# EAGLE board zx80_build034.routed (EAGLE 7.5.0), part 1 of 2
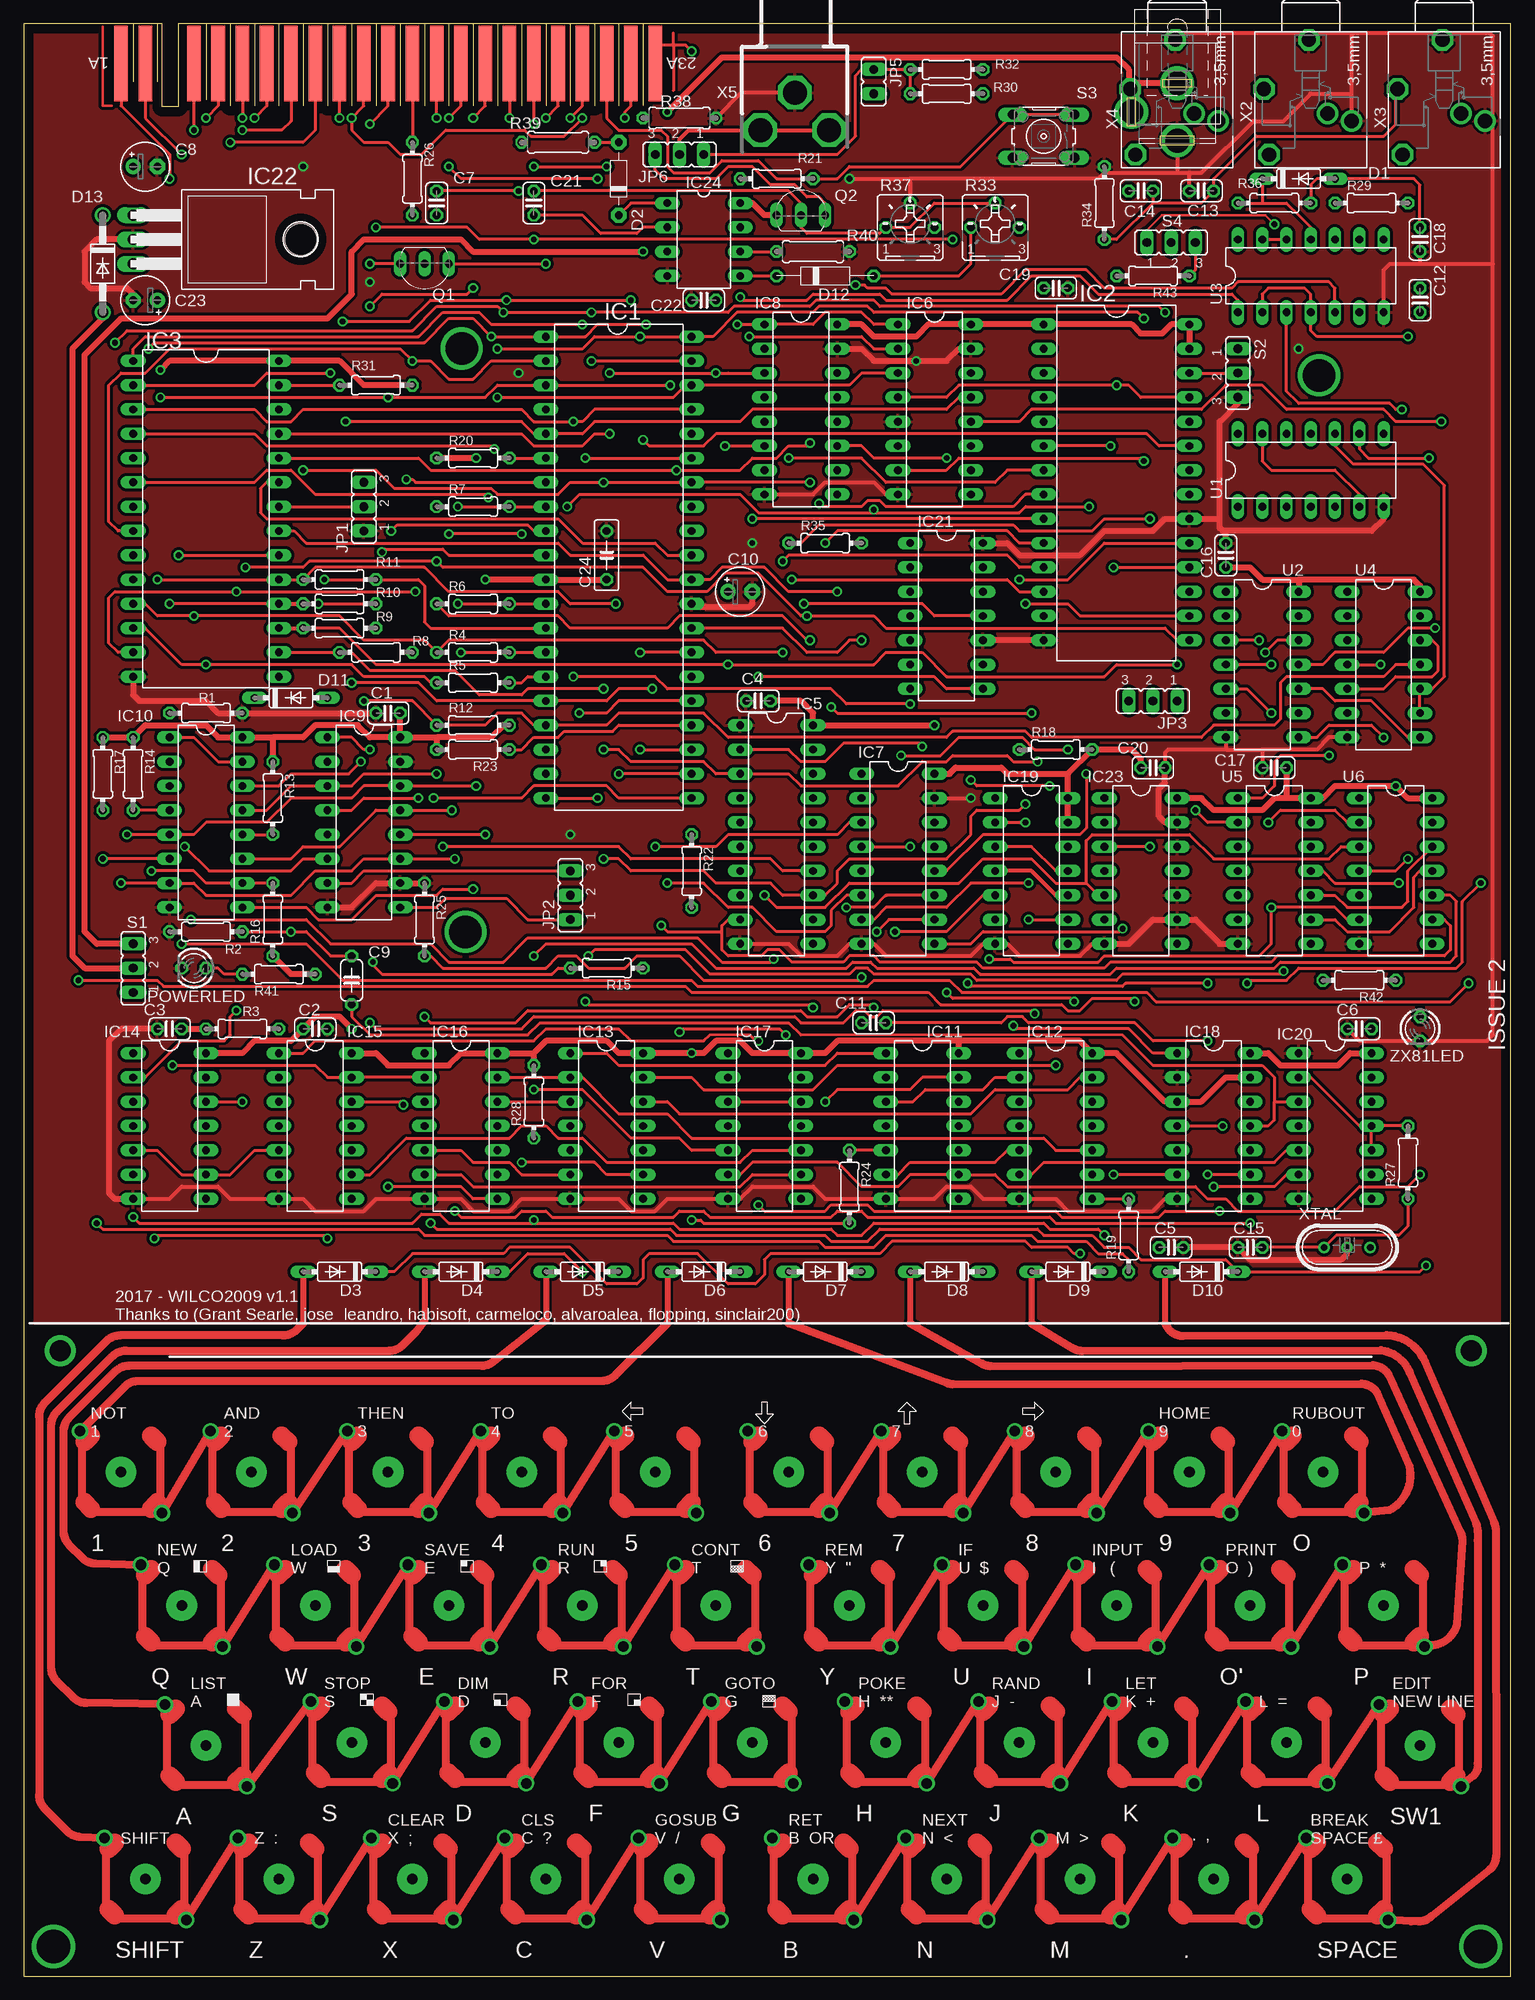
[diagram p4: board, top side]
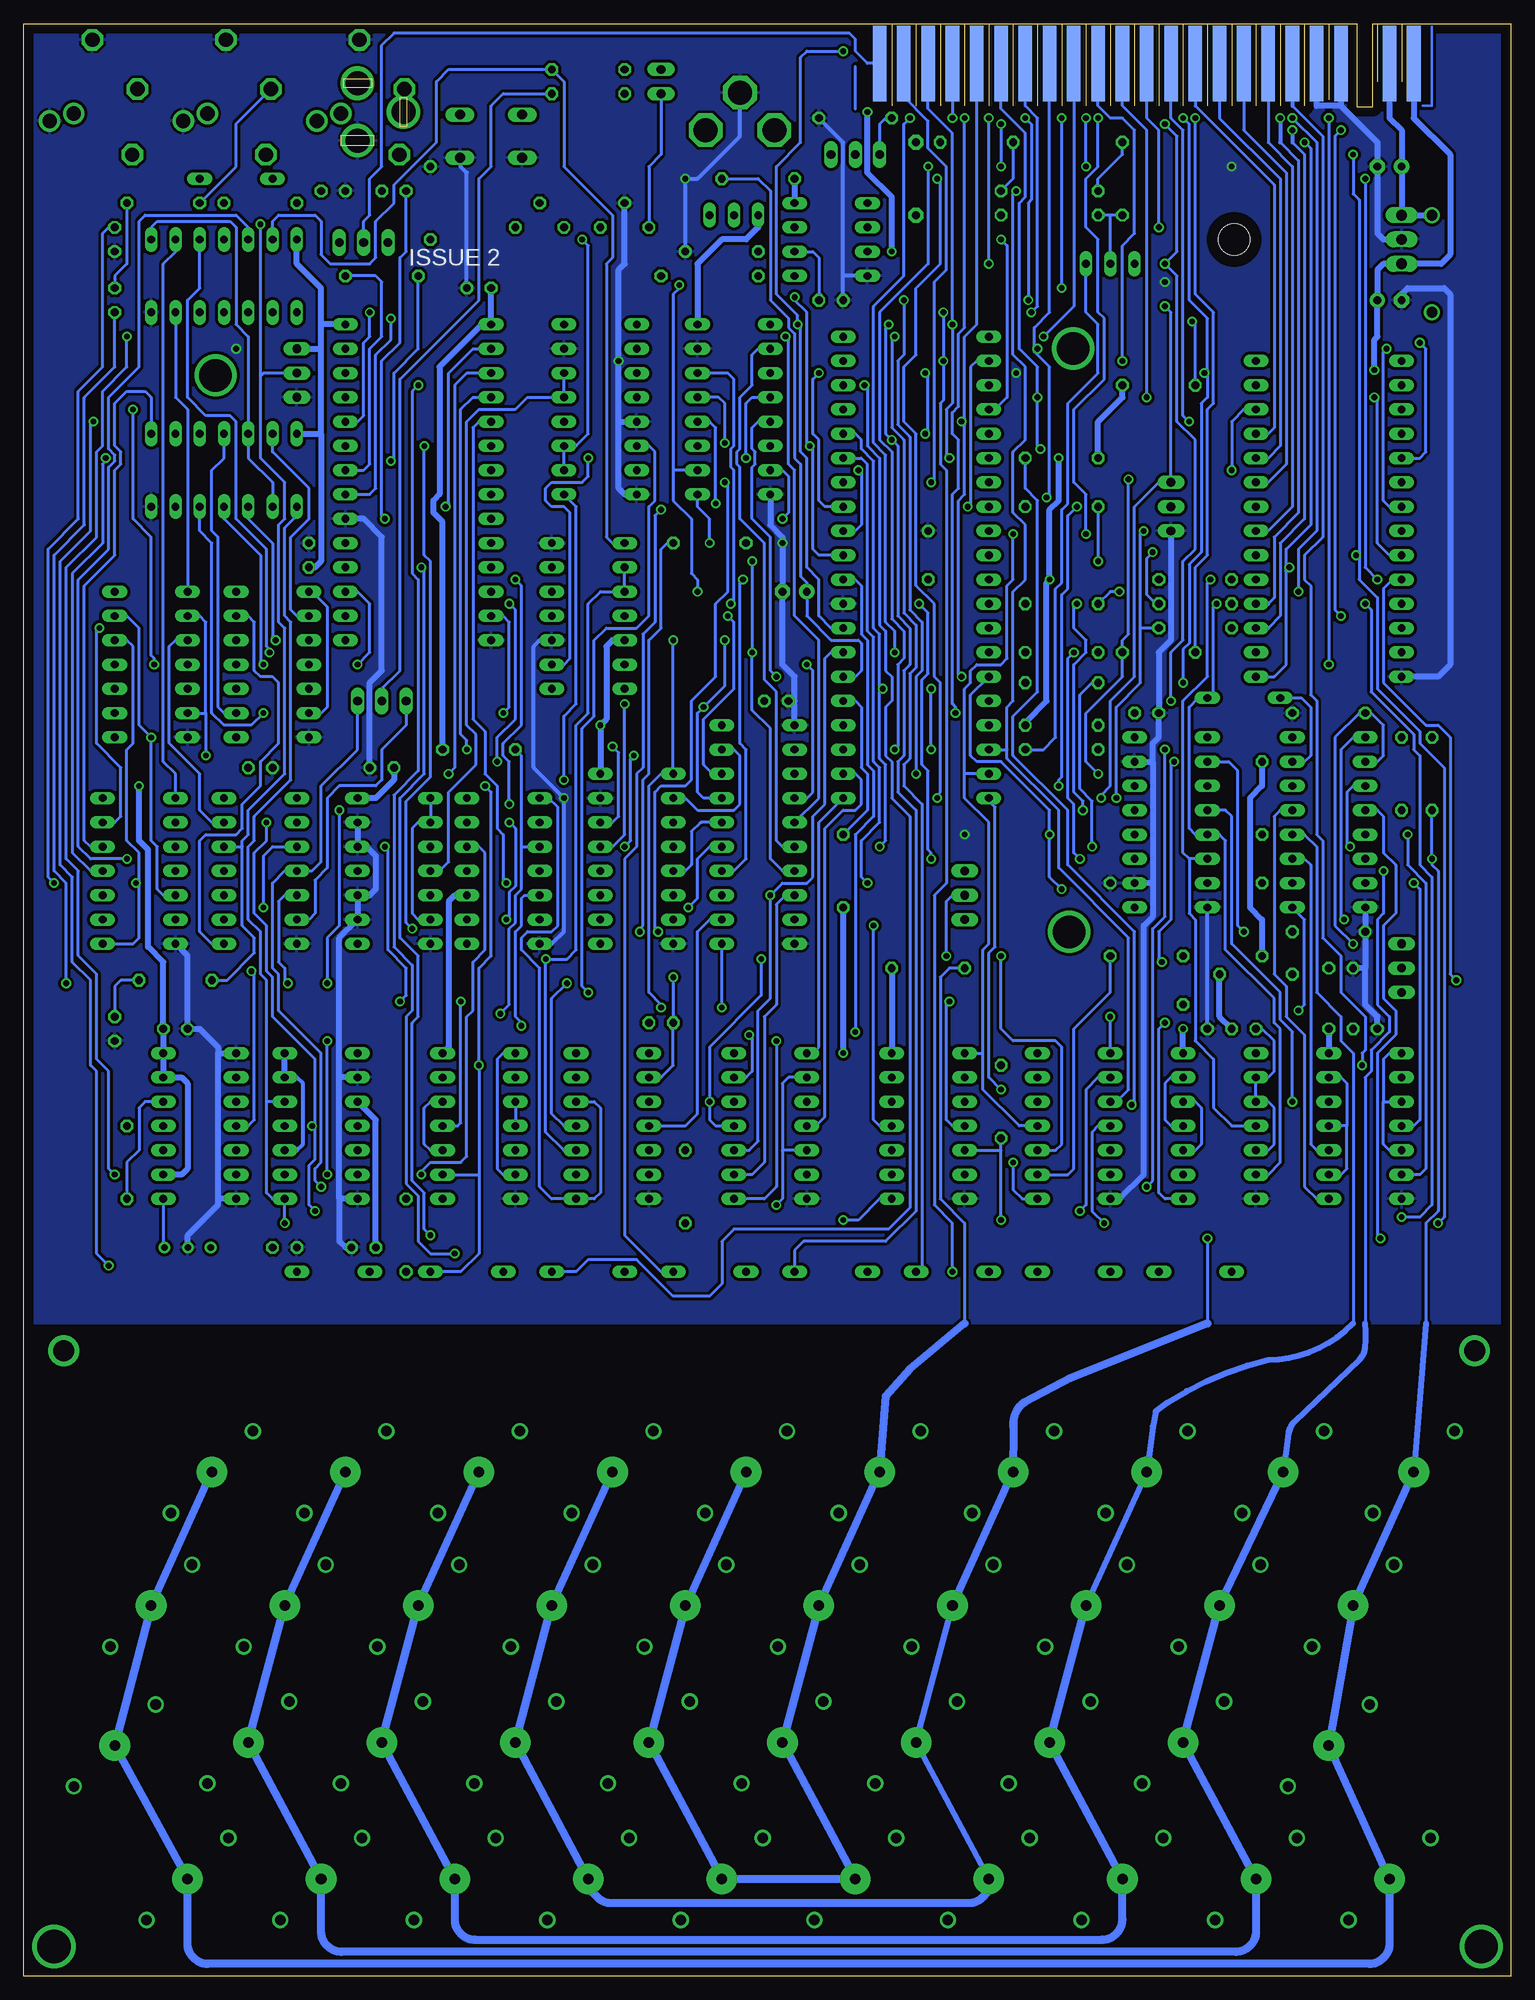
[diagram p5: board, bottom side, seen from below]

Size 155.56 x 204.15 mm. Coordinates in mm from the lower left corner, seen from the top.
Outline: 19.05,204.15 155.56,204.15 155.56,0 0,0 0,204.15 11.43,204.15
Outline: 19.05,204.15 16.14,204.15 16.14,195.47 14.46,195.47 14.46,204.15 13.97,204.15
Outline: 13.97,204.15 11.43,204.15
Outline: 19.05,204.15 19.05,196.22
Outline: 13.97,204.15 13.97,198.12
Outline: 11.43,204.15 11.43,198.12
Outline: 21.59,204.15 21.59,195.58
Outline: 26.67,204.15 26.67,195.58
Outline: 29.21,204.15 29.21,195.58
Outline: 34.29,204.15 34.29,195.58
Outline: 39.37,204.15 39.37,195.58
Outline: 41.91,204.15 41.91,195.58
Outline: 44.45,204.15 44.45,195.58
Outline: 46.99,204.15 46.99,195.58
Outline: 49.53,204.15 49.53,195.58
Outline: 24.13,204.15 24.13,195.58
Outline: 31.75,204.15 31.75,195.58
Outline: 36.83,204.15 36.83,195.58
Outline: 52.07,204.15 52.07,195.58
Outline: 54.61,204.15 54.61,195.58
Outline: 57.15,204.15 57.15,195.58
Outline: 59.69,204.15 59.69,195.58
Outline: 62.23,204.15 62.23,195.58
Outline: 64.77,204.15 64.77,195.58
Copper layers (1*16): Top 0.035mm / dielectric 1.5mm / Bottom 0.035mm
Design rules "default *": minimum track width 10mil, minimum drill 20mil, track to track 8mil, track to pad 8mil, pad to pad 8mil, via to via 8mil, smd to smd 8mil, copper to edge 40mil, drill to drill 8mil, minimum pad ring 10mil, minimum via ring 8mil, stop-mask expansion 4mil, vias tented up to drill 0mil, thermal gap 10mil
Net classes: 1 VCC: width 0.5 mm

## Footprints (pad centres in the part's own frame; a part is rotated, then mirrored left to right if it is on the bottom)
TA_DK = drill 1.1 pad 3.2: 1 0,0 | drill 1.1 pad 1.7: 2@1 4.282,-4.282; 2@8 -4.282,4.282
EDGEPIN = smd 1.422 x 7.874: 1 0,0
C025-024X044 = drill 0.813 octagon: 1 -1.27,0; 2 1.27,0
E2,5-5 = drill 0.813 pad 1.6: + -1.27,0 | drill 0.813 pad 1.6 octagon: - 1.27,0
C050-024X044 = drill 0.813 octagon: 1 -2.54,0; 2 2.54,0
C050-025X075 = drill 0.813 octagon: 1 -2.54,0; 2 2.54,0
DO35-7 = drill 0.813 long: A 3.81,0; C -3.81,0
D-7,5 = drill 0.813 pad 1.6 octagon: 1 -3.81,0; 2 3.81,0
D-10/2 = drill 0.813 octagon: P$3 -5.08,0; P$4 5.08,0
DO41-10 = drill 1.118: A 5.08,0; C -5.08,0
DIL40 = drill 0.813 long: 1 -24.13,-7.62; 2 -21.59,-7.62; 3 -19.05,-7.62; 4 -16.51,-7.62; 5 -13.97,-7.62; 6 -11.43,-7.62; 7 -8.89,-7.62; 8 -6.35,-7.62; 9 -3.81,-7.62; 10 -1.27,-7.62; 11 1.27,-7.62; 12 3.81,-7.62; 13 6.35,-7.62; 14 8.89,-7.62; 15 11.43,-7.62; 16 13.97,-7.62; 17 16.51,-7.62; 18 19.05,-7.62; 19 21.59,-7.62; 20 24.13,-7.62; 21 24.13,7.62; 22 21.59,7.62; 23 19.05,7.62; 24 16.51,7.62; 25 13.97,7.62; 26 11.43,7.62; 27 8.89,7.62; 28 6.35,7.62; 29 3.81,7.62; 30 1.27,7.62; 31 -1.27,7.62; 32 -3.81,7.62; 33 -6.35,7.62; 34 -8.89,7.62; 35 -11.43,7.62; 36 -13.97,7.62; 37 -16.51,7.62; 38 -19.05,7.62; 39 -21.59,7.62; 40 -24.13,7.62
DIL28-6 = drill 0.813 long: 1 -16.51,-7.62; 2 -13.97,-7.62; 3 -11.43,-7.62; 4 -8.89,-7.62; 5 -6.35,-7.62; 6 -3.81,-7.62; 7 -1.27,-7.62; 8 1.27,-7.62; 9 3.81,-7.62; 10 6.35,-7.62; 11 8.89,-7.62; 12 11.43,-7.62; 13 13.97,-7.62; 14 16.51,-7.62; 15 16.51,7.62; 16 13.97,7.62; 17 11.43,7.62; 18 8.89,7.62; 19 6.35,7.62; 20 3.81,7.62; 21 1.27,7.62; 22 -1.27,7.62; 23 -3.81,7.62; 24 -6.35,7.62; 25 -8.89,7.62; 26 -11.43,7.62; 27 -13.97,7.62; 28 -16.51,7.62
DIL20 = drill 0.813 long: 1 -11.43,-3.81; 2 -8.89,-3.81; 3 -6.35,-3.81; 4 -3.81,-3.81; 5 -1.27,-3.81; 6 1.27,-3.81; 7 3.81,-3.81; 8 6.35,-3.81; 9 8.89,-3.81; 10 11.43,-3.81; 11 11.43,3.81; 12 8.89,3.81; 13 6.35,3.81; 14 3.81,3.81; 15 1.27,3.81; 16 -1.27,3.81; 17 -3.81,3.81; 18 -6.35,3.81; 19 -8.89,3.81; 20 -11.43,3.81
DIL16 = drill 0.813 long: 1 -8.89,-3.81; 2 -6.35,-3.81; 3 -3.81,-3.81; 4 -1.27,-3.81; 5 1.27,-3.81; 6 3.81,-3.81; 7 6.35,-3.81; 8 8.89,-3.81; 9 8.89,3.81; 10 6.35,3.81; 11 3.81,3.81; 12 1.27,3.81; 13 -1.27,3.81; 14 -3.81,3.81; 15 -6.35,3.81; 16 -8.89,3.81
DIL14 = drill 0.813 long: 1 -7.62,-3.81; 2 -5.08,-3.81; 3 -2.54,-3.81; 4 0,-3.81; 5 2.54,-3.81; 6 5.08,-3.81; 7 7.62,-3.81; 8 7.62,3.81; 9 5.08,3.81; 10 2.54,3.81; 11 0,3.81; 12 -2.54,3.81; 13 -5.08,3.81; 14 -7.62,3.81
TO220H = drill 1.118 long: 1 -2.54,-12.7; 2 0,-12.7; 3 2.54,-12.7 | hole 3.302: 0,4.826
DIL08 = drill 0.813 long: 1 -3.81,-3.81; 2 -1.27,-3.81; 3 1.27,-3.81; 4 3.81,-3.81; 5 3.81,3.81; 6 1.27,3.81; 7 -1.27,3.81; 8 -3.81,3.81
SPC4077 = drill 2.5 pad 3.5: 1 -3,0; 2 0,-4.8; 3 3,0
JP2 = drill 0.914 long: 1 -2.54,0; 2 0,0; 3 2.54,0
JP1 = drill 0.914 long: 1 0,-1.27; 2 0,1.27
LED3MM = drill 0.813 octagon: A -1.27,0; K 1.27,0
TO92-EBC = drill 0.813 long: B 0,-1.27; C -2.54,-1.27; E 2.54,-1.27
0204/7 = drill 0.813 octagon: 1 -3.81,0; 2 3.81,0
B25P = drill 0.813 octagon: A -2.54,0; E 2.54,0; S 0,2.54
0207/7 = drill 0.813 octagon: 1 -3.81,0; 2 3.81,0
B3F-10XX = drill 1.016 long: 1 -3.251,2.261; 2 3.251,2.261; 3 -3.251,-2.261; 4 3.251,-2.261
PG203J = drill 1.499 octagon: 1 -6.274,-0.203; 4 5.74,-4.369; 5 -1.118,-4.902 | drill 1.499: 2 2.21,4.267; 3 1.448,1.753
736880-49 = drill 2.5 pad 3.302 octagon: 1 -0.11,0; 2 3.81,3.595; 2@2 3.81,-3.595
HC49U = drill 0.7 pad 1.2: 1 -2.413,0; 2 -0.027,0; 3 2.413,0

## Placement (x,y rotation side)
1  TA_DK  [TA_DK]  10.16,52.7 0 top
1A  [EDGEPIN]  10.16,200.03 0 top
1B  [EDGEPIN]  10.16,200.03 0 bottom
2  TA_DK  [TA_DK]  23.81,52.7 0 top
2A  [EDGEPIN]  12.7,200.03 0 top
2B  [EDGEPIN]  12.7,200.03 0 bottom
3  TA_DK  [TA_DK]  38.1,52.7 0 top
4  TA_DK  [TA_DK]  52.07,52.7 0 top
4A  [EDGEPIN]  17.78,200.03 0 top
4B  [EDGEPIN]  17.78,200.03 0 bottom
5  TA_DK  [TA_DK]  66.04,52.7 0 top
5A  [EDGEPIN]  20.32,200.03 0 top
5B  [EDGEPIN]  20.32,200.03 0 bottom
6  TA_DK  [TA_DK]  80.01,52.7 0 top
6A  [EDGEPIN]  22.86,200.03 0 top
6B  [EDGEPIN]  22.86,200.03 0 bottom
7  TA_DK  [TA_DK]  93.98,52.7 0 top
7A  [EDGEPIN]  25.4,200.03 0 top
7B  [EDGEPIN]  25.4,200.03 0 bottom
8  TA_DK  [TA_DK]  107.95,52.7 0 top
8A  [EDGEPIN]  27.94,200.03 0 top
8B  [EDGEPIN]  27.94,200.03 0 bottom
9  TA_DK  [TA_DK]  121.92,52.7 0 top
9A  [EDGEPIN]  30.48,200.03 0 top
9B  [EDGEPIN]  30.48,200.03 0 bottom
10A  [EDGEPIN]  33.02,200.03 0 top
10B  [EDGEPIN]  33.02,200.03 0 bottom
11A  [EDGEPIN]  35.56,200.03 0 top
11B  [EDGEPIN]  35.56,200.03 0 bottom
12A  [EDGEPIN]  38.1,200.03 0 top
12B  [EDGEPIN]  38.1,200.03 0 bottom
13A  [EDGEPIN]  40.64,200.03 0 top
13B  [EDGEPIN]  40.64,200.03 0 bottom
14A  [EDGEPIN]  43.18,200.03 0 top
14B  [EDGEPIN]  43.18,200.03 0 bottom
15A  [EDGEPIN]  45.72,200.03 0 top
15B  [EDGEPIN]  45.72,200.03 0 bottom
16A  [EDGEPIN]  48.26,200.03 0 top
16B  [EDGEPIN]  48.26,200.03 0 bottom
17A  [EDGEPIN]  50.8,200.03 0 top
17B  [EDGEPIN]  50.8,200.03 0 bottom
18A  [EDGEPIN]  53.34,200.03 0 top
18B  [EDGEPIN]  53.34,200.03 0 bottom
19A  [EDGEPIN]  55.88,200.03 0 top
19B  [EDGEPIN]  55.88,200.03 0 bottom
20A  [EDGEPIN]  58.42,200.03 0 top
20B  [EDGEPIN]  58.42,200.03 0 bottom
21A  [EDGEPIN]  60.96,200.03 0 top
21B  [EDGEPIN]  60.96,200.03 0 bottom
22A  [EDGEPIN]  63.5,200.03 0 top
22B  [EDGEPIN]  63.5,200.03 0 bottom
23A  [EDGEPIN]  66.04,200.03 0 top
23B  [EDGEPIN]  66.04,200.03 0 bottom
.  TA_DK  [TA_DK]  124.46,10.16 0 top
A  TA_DK  [TA_DK]  19.05,24.13 0 top
B  TA_DK  [TA_DK]  82.55,10.16 0 top
C  TA_DK  [TA_DK]  54.61,10.16 0 top
C1  47nF  [C025-024X044]  38.1,132.08 180 top
C2  47nF  [C025-024X044]  30.48,99.06 0 top
C3  47nF  [C025-024X044]  15.24,99.06 180 top
C4  47nF  [C025-024X044]  76.83,133.35 180 top
C5  47nF  [C025-024X044]  120.02,76.2 0 top
C6  100nF  [C025-024X044]  139.7,99.06 180 top
C7  100pF  [C025-024X044]  43.18,185.42 90 top
C8  22uF  [E2,5-5]  12.7,189.23 0 top
C9  47pF  [C050-024X044]  34.29,104.14 270 top
C10  1uF  [E2,5-5]  74.93,144.78 0 top
C11  47pF  [C025-024X044]  88.9,99.69 180 top
C12  47nF  [C025-024X044]  146.05,175.26 270 top
C13  47nF  [C025-024X044]  123.19,186.69 180 top
C14  47pF  [C025-024X044]  116.84,186.69 0 top
C15  220pF  [C025-024X044]  128.27,76.2 0 top
C16  47nF  [C025-024X044]  125.73,148.59 90 top
C17  47nF  [C025-024X044]  130.81,126.36 180 top
C18  10nF  [C025-024X044]  146.05,181.61 270 top
C19  47nF  [C025-024X044]  107.95,176.53 0 top
C20  47nF  [C025-024X044]  118.11,126.36 0 top
C21  100nF  [C025-024X044]  53.34,185.42 270 top
C22  100n  [C025-024X044]  71.12,175.26 0 top
C23  100uF  [E2,5-5]  12.7,175.26 180 top
C24  100nF  [C050-025X075]  60.96,148.59 90 top
D  TA_DK  [TA_DK]  48.26,24.45 0 top
D1  1N4148DO35-7  [DO35-7]  133.35,187.96 0 top
D2  [D-7,5]  62.23,187.96 270 top
D3  1N4148DO35-7  [DO35-7]  33.02,73.66 180 top
D4  1N4148DO35-7  [DO35-7]  45.72,73.66 180 top
D5  1N4148DO35-7  [DO35-7]  58.42,73.66 180 top
D6  1N4148DO35-7  [DO35-7]  71.12,73.66 180 top
D7  1N4148DO35-7  [DO35-7]  83.82,73.66 180 top
D8  1N4148DO35-7  [DO35-7]  96.52,73.66 180 top
D9  1N4148DO35-7  [DO35-7]  109.22,73.66 180 top
D10  1N4148DO35-7  [DO35-7]  123.19,73.66 180 top
D11  NTSC ONLY  [DO35-7]  27.94,133.67 0 top
D12  [D-10/2]  83.82,177.8 180 top
D13  1N4007  [DO41-10]  8.26,179.07 270 top
E  TA_DK  [TA_DK]  44.45,38.73 0 top
F  TA_DK  [TA_DK]  62.23,24.45 0 top
G  TA_DK  [TA_DK]  76.2,24.45 0 top
H  TA_DK  [TA_DK]  90.17,24.45 0 top
I  TA_DK  [TA_DK]  114.3,38.73 0 top
IC1  Z80A  [DIL40]  62.23,147.32 270 top
IC2  27C128P  [DIL28-6]  114.3,156.21 270 top
IC3  CY62256LL-PC  [DIL28-6]  19.05,152.4 270 top
IC5  74S373N  [DIL20]  78.74,119.38 270 top
IC6  74157N  [DIL16]  95.25,163.83 270 top
IC7  74157N  [DIL16]  91.44,116.84 270 top
IC8  74157N  [DIL16]  81.28,163.83 270 top
IC9  74165N  [DIL16]  35.56,120.65 270 top
IC10  74LS365N  [DIL16]  19.05,120.65 270 top
IC11  74LS00N  [DIL14]  93.98,88.9 270 top
IC12  74LS00N  [DIL14]  107.95,88.9 270 top
IC13  74LS04N  [DIL14]  60.96,88.9 270 top
IC14  74LS05N  [DIL14]  15.24,88.9 270 top
IC15  74LS05N  [DIL14]  30.48,88.9 270 top
IC16  74LS10N  [DIL14]  45.72,88.9 270 top
IC17  74LS32N  [DIL14]  77.47,88.9 270 top
IC18  74LS74N  [DIL14]  124.46,88.9 270 top
IC19  74LS74N  [DIL14]  105.41,115.57 270 top
IC20  74LS86N  [DIL14]  137.16,88.9 270 top
IC21  74LS93N  [DIL14]  96.52,142.24 270 top
IC22  7805T  [TO220H]  24.13,181.61 270 top
IC23  74LS00N  [DIL14]  116.84,115.57 270 top
IC24  LM1881  [DIL08]  71.12,181.61 270 top
J  TA_DK  [TA_DK]  104.14,24.45 0 top
J1  [SPC4077]  120.65,194.94 270 top
JP1  [JP2]  35.56,153.67 90 top
JP2  VIDEO_MODE  [JP2]  57.15,113.03 90 top
JP3  [JP2]  118.11,133.35 180 top
JP5  [JP1]  88.9,198.12 180 top
JP6  [JP2]  68.58,190.5 180 top
K  TA_DK  [TA_DK]  118.11,24.45 0 top
L  TA_DK  [TA_DK]  132.08,24.45 0 top
M  TA_DK  [TA_DK]  110.49,10.16 0 top
N  TA_DK  [TA_DK]  96.52,10.16 0 top
O  TA_DK  [TA_DK]  135.89,52.7 0 top
O'  TA_DK  [TA_DK]  128.27,38.73 0 top
P  TA_DK  [TA_DK]  142.24,38.73 0 top
POWERLED  RED  [LED3MM]  17.78,105.41 180 top
Q  TA_DK  [TA_DK]  16.51,38.73 0 top
Q1  BC548  [TO92-EBC]  41.91,177.8 180 top
Q2  BC548  [TO92-EBC]  81.28,185.42 0 top
R  TA_DK  [TA_DK]  58.42,38.73 0 top
R1  1K  [0204/7]  19.05,132.08 180 top
R2  470  [0204/7]  19.05,109.22 0 top
R3  1K  [0204/7]  22.86,99.06 0 top
R4  1K  [0204/7]  46.99,138.43 0 top
R5  1K  [0204/7]  46.99,135.25 0 top
R6  1K  [0204/7]  46.99,143.51 0 top
R7  1K  [0204/7]  46.99,153.67 0 top
R8  1K  [0204/7]  36.83,138.43 0 top
R9  1K  [0204/7]  33.02,140.97 0 top
R10  1K  [0204/7]  33.02,143.51 0 top
R11  1K  [0204/7]  33.02,146.05 0 top
R12  1K  [0204/7]  46.99,130.81 0 top
R13  47K  [0204/7]  26.04,123.19 270 top
R14  47K  [0204/7]  11.43,125.73 270 top
R15  47K  [0204/7]  60.96,105.41 180 top
R16  47K  [0204/7]  26.04,110.49 90 top
R17  47K  [0204/7]  8.26,125.73 270 top
R18  1K  [0204/7]  107.95,128.27 180 top
R19  2K2  [0204/7]  115.57,77.47 90 top
R20  330  [0204/7]  46.99,158.75 180 top
R21  220K  [0204/7]  78.74,187.96 180 top
R22  1K  [0204/7]  69.85,115.57 270 top
R23  1K  [0204/7]  46.99,128.27 180 top
R24  1K  [0204/7]  86.36,82.55 270 top
R25  470  [0204/7]  41.91,110.49 270 top
R26  10K  [0204/7]  40.64,187.96 270 top
R27  1K  [0204/7]  144.78,85.09 90 top
R28  47K  [0204/7]  53.34,91.44 90 top
R29  180  [0204/7]  140.97,185.42 0 top
R30  1K  [0204/7]  96.52,196.85 180 top
R31  10K  [0204/7]  36.83,166.37 180 top
R32  330  [0204/7]  96.52,199.39 180 top
R33  1K  [B25P]  101.6,182.88 0 top
R34  1K  [0204/7]  113.03,185.42 90 top
R35  1M  [0204/7]  83.82,149.86 0 top
R36  2K7  [0204/7]  130.81,185.42 180 top
R37  4K7  [B25P]  92.71,182.88 0 top
R38  100  [0207/7]  68.58,194.31 180 top
R39  10k  [0207/7]  55.88,191.77 0 top
R40  820k  [0207/7]  82.55,180.34 180 top
R41  680  [0204/7]  26.67,104.78 180 top
R42  680  [0204/7]  139.7,104.14 180 top
R43  680  [0204/7]  118.11,177.8 180 top
S  TA_DK  [TA_DK]  34.29,24.45 0 top
S1  [JP2]  11.43,105.41 90 top
S2  [JP2]  127,167.64 270 top
S3  RESET  [B3F-10XX]  106.68,192.41 180 top
S4  [JP2]  120.02,181.29 0 top
SHIFT  TA_DK  [TA_DK]  12.7,10.16 0 top
SPACE  TA_DK  [TA_DK]  138.43,10.16 0 top
SW1  TA_DK  [TA_DK]  146.05,24.13 0 top
T  TA_DK  [TA_DK]  72.39,38.73 0 top
U  TA_DK  [TA_DK]  100.33,38.73 0 top
U1  74HC393N  [DIL14]  134.62,157.48 0 top
U2  74AC11N  [DIL14]  129.54,137.16 270 top
U3  74LS32N  [DIL14]  134.62,177.8 0 top
U4  74LS00N  [DIL14]  142.24,137.16 270 top
U5  74LS08N  [DIL14]  130.81,115.57 270 top
U6  74LS02N  [DIL14]  143.51,115.57 270 top
V  TA_DK  [TA_DK]  68.58,10.16 0 top
W  TA_DK  [TA_DK]  30.48,38.73 0 top
X  TA_DK  [TA_DK]  40.64,10.16 0 top
X2  EAR  [PG203J]  134.62,196.22 270 top
X3  MIC  [PG203J]  148.59,196.22 270 top
X4  POWER  [PG203J]  120.65,196.22 270 top
X5  736880-49  [736880-49]  80.64,196.85 270 top
XTAL  6.5MHz  [HC49U]  138.43,76.2 0 top
Y  TA_DK  [TA_DK]  86.36,38.73 0 top
Z  TA_DK  [TA_DK]  26.67,10.16 0 top
ZX81LED  YELLOW  [LED3MM]  146.05,99.06 270 top

## Tracks (layer width: path | path; a pad name or v marks a point on that pad's centre or on a via)
2CLK
  Top 0.254: 81.28,98.42 114.94,98.42
  Top 0.305: C9.2 34.29,100.33 36.2,98.42 52.7,98.42 53.98,99.69 80.01,99.69 81.28,98.42 | 114.94,98.42 118.11,95.25 129.54,95.25 130.81,93.98 130.81,91.44 | 130.81,91.44 IC20.3 | IC18.11 130.18,88.9 130.81,89.53 130.81,91.44
9V
  Bottom 0.61: 2B.1 12.7,194.31 11.43,193.04 C8.+ IC22.1 D13.C
/BUSAK  (via drill 0.6)
  Top 0.305: 18A.1 v53.34,193.68 | v53.34,189.23 v60.96,189.23 | v64.45,128.27 IC1.23
  Bottom 0.305: v53.34,193.68 v53.34,189.23 | v60.96,189.23 60.96,179.07 66.04,173.99 66.04,160.66 64.77,159.38 64.77,141.92 63.5,140.65 63.5,137.79 64.14,137.16 64.14,128.59 v64.45,128.27
/BUSRQ  (via drill 0.6)
  Top 0.305: IC1.25 62.23,133.35 60.96,132.08 v58.1,132.08 | v57.15,194.31 58.42,195.58 20A.1
  Bottom 0.305: IC1.25 68.58,133.35 67.94,132.72 67.94,126.36 67.31,125.73 67.31,121.92 R22.1 | v58.1,132.08 58.1,132.72 58.42,133.03 58.42,154.94 57.78,155.57 57.78,160.66 58.42,161.29 58.42,163.51 57.78,164.15 57.78,171.77 57.15,172.4 v57.15,194.31
/CLOCK  (via drill 0.6)
  Top 0.305: v15.56,95.25 30.48,95.25 31.75,93.98 IC15.13 IC16.2 | v45.09,80.01 45.72,79.38 51.44,79.38 52.07,80.01 54.61,80.01 55.24,79.38 67.94,79.38 68.58,80.01 71.12,80.01 71.75,79.38 84.45,79.38 85.09,80.01 87.63,80.01 88.27,79.38 107.31,79.38 107.95,78.74 v128.27,78.74
  Bottom 0.305: 22.86,195.58 19.68,192.41 19.68,150.5 21.59,148.59 21.59,146.05 20.95,145.41 20.95,133.99 20.32,133.35 20.32,119.38 19.68,118.75 19.68,108.58 17.78,106.68 17.78,102.87 15.24,100.33 15.24,96.84 15.56,96.52 v15.56,95.25 | IC15.13 35.56,93.98 36.2,93.34 36.2,89.53 35.56,88.9 IC15.11 | IC16.2 43.18,93.98 44.45,92.71 44.45,80.64 v45.09,80.01 | v128.27,78.74 IC18.8 129.54,81.28 130.18,81.92 130.18,91.44 | IC18.12 130.18,91.44 | 130.18,91.44 130.18,104.14 130.81,104.78 130.81,109.22 132.08,110.49 132.08,118.11 131.44,118.75 131.44,121.28 127.64,125.09 127.64,141.6 128.27,142.24 128.27,151.45 127,152.72 U1.1
  Bottom 0.406: 6B.1 22.86,195.58
/HALT  (via drill 0.6)
  Top 0.305: v51.75,186.69 C7.2 | 13A.1 R26.1
  Bottom 0.305: IC16.3 41.27,91.44 40.01,92.71 40.01,108.58 47.31,115.89 47.31,121.92 52.7,127.32 52.7,128.27 | IC1.18 52.7,128.27 | 52.7,128.27 52.7,132.72 52.07,133.35 52.07,144.78 50.8,146.05 50.8,151.76 52.07,153.03 52.07,159.38 50.8,160.66 50.8,168.28 52.07,169.54 52.07,186.37 v51.75,186.69 | C7.2 43.18,187.96 40.64,190.5 R26.1
/IORQ  (via drill 0.6)
  Top 0.305: v76.83,80.64 77.47,80.01 83.82,80.01 84.45,80.64 88.27,80.64 88.9,80.01 107.95,80.01 108.58,79.38 118.75,79.38 119.38,80.01 v125.09,80.01 | IC18.4 v125.41,88.9 | v130.18,120.65 131.44,121.92 137.16,121.92 138.43,120.65 U6.2 | IC17.5 69.85,86.36 68.58,87.63 63.5,87.63 58.42,92.71 v53.34,92.71 | IC1.20 v60.01,123.19 | v60.01,187.96 45.72,187.96 v44.45,189.23 | v44.45,194.31 45.72,195.58 15A.1
  Bottom 0.305: IC17.2 75.56,93.98 76.2,93.34 76.2,86.36 | 76.2,86.36 76.2,81.28 v76.83,80.64 | IC17.5 76.2,86.36 | v125.09,80.01 125.73,80.64 125.73,84.77 125.09,85.41 125.09,88.58 v125.41,88.9 125.09,89.22 125.09,95.89 129.54,100.33 129.54,104.46 130.18,105.09 130.18,109.86 131.44,111.12 131.44,117.47 130.18,118.75 v130.18,120.65 | v53.34,92.71 54.61,93.98 54.61,107 53.98,107.63 53.98,122.24 54.61,122.87 IC1.20 | v60.01,123.19 60.01,123.51 59.69,123.83 59.69,135.25 60.33,135.89 60.33,143.51 62.23,145.41 62.23,161.29 63.5,162.56 63.5,168.28 62.23,169.54 62.23,176.53 59.69,179.07 59.69,187.64 v60.01,187.96 | v44.45,189.23 v44.45,194.31
/IORQ+/WR  (via drill 0.6)
  Top 0.305: IC17.6 74.93,83.82 76.2,85.09 85.09,85.09 87.63,82.55 91.44,82.55 92.71,83.82 IC11.9 101.6,83.82 102.87,82.55 122.56,82.55 123.83,81.28 125.73,81.28 127,80.01 137.16,80.01 139.7,82.55 144.78,82.55 v146.05,83.82 | v144.78,171.45 135.25,171.45 134.62,172.09 U3.4 134.62,175.9 133.99,176.53 130.18,176.53 129.54,175.9 U3.2
  Bottom 0.305: v146.05,83.82 146.69,84.45 146.69,94.61 147.96,95.89 147.96,104.78 149.86,106.68 149.86,115.57 151.13,116.84 151.13,147.32 147.96,150.5 147.96,159.38 147.32,160.02 147.32,165.74 144.78,168.28 v144.78,171.45
/KBD  (via drill 0.6)
  Top 0.305: IC10.1 17.78,129.54 20.32,127 IC10.15 | v17.46,110.49 29.53,110.49 32.07,107.95 42.55,107.95 44.45,106.05 50.16,106.05 52.7,108.58 70.48,108.58 73.03,106.05 78.11,106.05 v78.42,106.36 | IC11.13 93.98,93.98 92.71,92.71 85.09,92.71 v83.82,91.44
  Bottom 0.305: IC10.1 16.51,129.54 17.78,128.27 17.78,110.81 v17.46,110.49 | v78.42,106.36 78.42,102.55 83.82,97.16 v83.82,91.44 83.82,89.53 83.19,88.9 IC17.11 | D11.C 21.91,133.67 20.95,132.72 20.95,127.64 21.59,127 IC10.15
/M1  (via drill 0.6)
  Top 0.305: IC15.9 36.2,83.82 40.01,87.63 50.8,87.63 52.07,88.9 54.61,88.9 55.88,87.63 58.42,87.63 60.96,85.09 74.93,85.09 76.2,86.36 IC17.10 | v77.47,113.03 78.74,111.76 83.82,111.76 86.36,114.3 97.79,114.3 100.33,116.84 105.41,116.84 107.95,114.3 111.12,114.3 | 111.12,114.3 112.39,113.03 IC23.5 | 111.12,114.3 111.12,118.75 111.76,119.38 121.92,119.38 124.46,116.84 136.53,116.84 137.79,118.11 U6.3 | IC1.27 v64.45,138.43 | v62.87,194.31 62.87,194.94 63.5,195.58 22A.1
  Bottom 0.305: IC17.10 79.69,86.36 78.74,87.31 78.74,100.97 77.47,102.23 v77.47,113.03 76.2,114.3 73.66,114.3 73.03,114.94 73.03,121.28 71.75,122.56 71.75,137.79 71.12,138.43 IC1.27 | v64.45,138.43 64.45,140.65 65.41,141.6 65.41,159.07 66.67,160.34 66.67,174.62 63.5,177.8 63.5,193.68 v62.87,194.31
/MREQ  (via drill 0.6)
  Top 0.305: v52.07,150.81 v44.45,150.81 | v43.18,194.31 14A.1 | IC13.1 60.96,96.52 62.23,95.25 83.82,95.25 85.09,96.52 IC11.1
  Bottom 0.305: IC16.11 51.44,88.9 55.24,92.71 55.24,96.52 | IC13.1 55.24,96.52 | 55.24,96.52 55.24,107.31 54.61,107.95 54.61,120.65 57.15,123.19 57.15,125.73 | 57.15,125.73 57.15,134.62 56.52,135.25 56.52,136.53 55.88,137.16 53.34,137.16 52.7,137.79 52.7,145.41 52.07,146.05 v52.07,150.81 | IC1.19 57.15,125.73 | v44.45,150.81 44.45,154.94 45.72,156.21 45.72,163.83 42.55,167 42.55,173.35 43.18,173.99 43.18,181.61 44.45,182.88 44.45,187.96 43.18,189.23 v43.18,194.31
/NMI  (via drill 0.6)
  Top 0.305: U4.11 143.51,137.16 142.24,135.89 132.08,135.89 131.44,135.25 131.44,131.44 130.81,130.81 124.46,130.81 123.19,129.54 105.41,129.54 104.78,130.18 97.16,130.18 96.52,129.54 73.66,129.54 71.12,132.08 62.23,132.08 60.96,130.81 IC1.17 53.34,130.81 52.07,132.08 49.53,132.08 48.26,130.81 R12.1 40.64,133.35 v35.56,133.35 | Q1.E v36.2,179.07 | v36.2,193.68 38.1,195.58 12A.1
  Bottom 0.305: v35.56,133.35 35.56,138.43 34.29,139.7 34.29,147.96 33.02,149.22 33.02,160.66 34.92,162.56 34.92,177.8 v36.2,179.07 34.92,180.34 34.92,192.41 v36.2,193.68
/RAMCS  (via drill 0.6)
  Top 0.305: 2A.1 12.7,194.31 v16.51,190.5 | v16.19,148.59 IC3.20 | v7.62,78.74 8.26,78.11 41.27,78.11 41.91,77.47 67.31,77.47 67.94,76.83 83.19,76.83 83.82,76.2 88.9,76.2 90.17,77.47 105.41,77.47 106.05,76.83 111.12,76.83 112.39,75.56 114.94,75.56 115.57,74.93 R19.1
  Bottom 0.305: v16.51,190.5 16.51,186.37 15.88,185.74 15.88,148.59 | 15.88,148.59 v16.19,148.59 | 15.88,148.59 15.88,146.05 13.97,144.15 13.97,134.62 9.53,130.18 9.53,128.91 6.99,126.36 6.99,79.38 v7.62,78.74
/RD  (via drill 0.6)
  Top 0.305: IC1.21 62.23,123.19 60.96,124.46 53.34,124.46 52.07,123.19 v42.86,123.19 | v36.2,174.62 37.47,175.9 46.35,175.9 v46.99,176.53 | v46.99,194.31 48.26,195.58 16A.1
  Bottom 0.305: IC17.1 73.03,96.52 72.39,97.16 72.39,120.65 IC1.21 | v42.86,123.19 42.86,123.51 41.91,124.46 41.91,133.35 39.37,135.89 39.37,153.67 36.83,156.21 JP1.3 35.56,173.99 v36.2,174.62 | v46.99,176.53 v46.99,194.31
/RESET
  Top 0.305: S3.3 S3.4 97.99,189.23 86.36,189.23 85.09,187.96 R21.1 78.74,187.96 76.83,189.87 73.03,189.87 71.75,188.59 67.94,188.59 67.31,189.23 67.31,192.41 66.67,193.04 62.23,193.04 60.96,194.31 21A.1
  Bottom 0.305: R21.1 78.74,187.96 77.47,186.69 77.47,175.26 75.56,173.35 75.56,172.4 74.93,171.77 74.93,158.75 74.3,158.12 74.3,146.37 73.66,145.73 C10.+ 73.66,142.24 71.12,139.7 68.26,139.7 67.94,139.38 67.94,136.53 68.58,135.89 IC1.26
/RFSH  (via drill 0.6)
  Top 0.305: v41.91,100.33 42.55,99.69 51.44,99.69 52.7,100.97 81.28,100.97 81.92,100.33 85.09,100.33 86.36,101.6 88.58,101.6 v88.9,101.28 | v87.63,139.7 86.36,139.7 85.09,138.43 81.92,138.43 79.38,140.97 IC1.28 | v74.61,172.72 IC8.1 82.55,172.72 83.82,173.99 87.63,173.99 88.9,172.72 IC6.1 | v69.85,201.29 69.22,201.93 67.94,201.93 | 67.94,201.93 66.67,201.93 66.04,201.29 23A.1 | 67.94,201.93 67.94,203.2 | 67.94,201.93 67.94,197.17
  Bottom 0.305: IC16.1 v41.91,100.33 | v88.9,101.28 88.9,101.6 90.17,102.87 90.17,124.46 88.9,125.73 IC7.1 v87.63,139.7 | IC1.28 71.12,140.97 72.39,142.24 72.39,146.05 73.66,147.32 73.66,158.75 74.3,159.38 74.3,172.4 v74.61,172.72 74.61,173.67 76.83,175.9 76.83,189.23 74.3,191.77 74.3,200.66 73.66,201.29 v69.85,201.29
/ROMCS'
  Top 0.305: S4.3 122.56,178.44 R43.1
  Bottom 0.305: IC2.22 120.02,157.48 119.38,158.12 119.38,170.18 118.11,171.45 118.11,177.16 118.75,177.8 R43.1
/ROMOE  (via drill 0.6)
  Top 0.305: IC6.7 96.52,157.48 97.79,158.75 116.84,158.75 v117.16,158.43
  Bottom 0.305: v117.16,158.43 116.84,158.75 116.84,167.64 114.3,170.18 R43.2
/WAIT  (via drill 0.6)
  Top 0.305: R23.1 52.07,128.27 53.34,129.54 55.88,129.54 56.52,130.18 61.59,130.18 62.23,130.81 IC1.24 | Q1.C v54.61,179.07 | v54.61,194.31 55.88,195.58 19A.1
  Bottom 0.305: R23.1 48.9,128.27 47.62,129.54 47.62,145.1 46.99,145.73 46.99,153.35 46.35,153.99 46.35,164.47 43.18,167.64 43.18,172.72 44.45,173.99 Q1.C | v54.61,179.07 v54.61,194.31
/WR  (via drill 0.6)
  Top 0.305: IC3.27 R31.2 | IC1.22 v62.23,125.73 | 17A.1 v50.8,194.31 | v63.5,175.26 v50.48,175.26 42.55,175.26 40.32,173.04 v33.34,173.04
  Bottom 0.305: IC17.4 72.71,88.9 71.75,89.85 71.75,120.02 69.85,121.92 68.58,121.92 67.94,122.56 67.94,125.09 68.58,125.73 IC1.22 | v50.8,194.31 50.16,193.68 50.16,185.74 50.48,185.42 v50.48,175.26 | v63.5,175.26 63.5,169.54 64.14,168.91 64.14,162.24 62.87,160.97 62.87,142.88 61.59,141.6 61.59,136.53 62.23,135.89 v62.23,125.73 | R31.2 33.02,172.72 v33.34,173.04
A0  (via drill 0.6)
  Top 0.305: IC3.21 28.26,151.13 29.53,149.86 55.88,149.86 57.15,148.59 64.77,148.59 67.31,146.05 IC1.30 71.75,146.05 73.03,147.32 77.47,147.32 80.01,144.78 v85.09,144.78 | v68.58,98.74 68.9,99.06 79.06,99.06 v79.69,98.42 | U3.5 137.16,176.53 136.53,177.16 127,177.16 126.36,176.53 113.03,176.53 111.12,178.44 104.78,178.44 102.23,175.9 90.81,175.9 90.17,176.53 88.27,176.53 87.95,176.85 v87,176.85
  Bottom 0.305: 7B.1 25.4,191.77 22.86,189.23 22.86,153.67 25.4,151.13 IC3.21 | IC1.30 68.58,146.05 67.94,145.41 67.94,140.34 67.31,139.7 67.31,126.68 66.67,126.05 66.67,121.28 68.58,119.38 v68.58,98.74 | v79.69,98.42 79.38,98.11 79.38,94.61 80.01,93.98 IC17.13 | v87,176.85 87,176.53 87.63,175.9 87.63,157.48 | 87.63,157.48 87.63,154.31 85.72,152.4 85.72,146.69 85.09,146.05 v85.09,144.78 | IC8.10 87.63,157.48
A0'  (via drill 0.6)
  Top 0.305: IC2.10 104.14,149.86 102.87,151.13 85.09,151.13 v83.82,149.86
  Bottom 0.305: v83.82,149.86 83.82,152.4 85.09,153.67 IC8.9
A1  (via drill 0.6)
  Top 0.305: IC3.23 25.4,156.21 24.77,155.57 24.77,153.03 25.4,152.4 55.88,152.4 58.42,149.86 66.04,149.86 67.31,148.59 IC1.31 | v73.34,160.02 IC8.6 | v74.93,175.58 75.25,175.26 81.92,175.26 82.55,175.9 89.53,175.9 90.17,175.26 102.87,175.26 105.41,177.8 110.49,177.8 112.39,175.9 126.36,175.9 127,175.26 U3.1
  Bottom 0.305: 8B.1 27.94,193.04 23.5,188.59 23.5,158.12 25.4,156.21 IC3.23 | IC1.31 72.39,148.59 73.03,149.22 73.03,159.7 v73.34,160.02 73.66,160.34 73.66,173.99 74.93,175.26 v74.93,175.58
A1'  (via drill 0.6)
  Top 0.305: IC2.9 v76.2,152.4
  Bottom 0.305: IC8.7 76.2,157.48 75.56,156.84 75.56,153.03 v76.2,152.4
A2  (via drill 0.6)
  Top 0.305: IC3.24 41.27,158.75 42.55,157.48 v68.26,157.48 74.93,157.48 76.2,158.75 78.74,158.75 80.01,160.02 81.92,160.02 v82.23,160.34
  Bottom 0.305: 9B.1 30.48,194.31 24.13,187.96 24.13,160.02 25.4,158.75 IC3.24 | v68.26,157.48 67.94,157.16 67.94,151.76 68.58,151.13 IC1.32 | v82.23,160.34 82.23,164.47 82.87,165.1 IC8.13
A2'  (via drill 0.6)
  Top 0.305: IC2.8 104.78,154.94 103.5,153.67 90.17,153.67 89.53,154.31 88.27,154.31 87.63,153.67 83.5,153.67 v83.19,153.99
  Bottom 0.305: v83.19,153.99 83.19,161.93 83.82,162.56 IC8.12
A3  (via drill 0.6)
  Top 0.305: IC3.25 52.07,161.29 53.34,160.02 58.42,160.02 59.69,161.29 v61.28,161.29 | v61.28,167.64 v72.39,167.64 73.66,167.64 IC8.3
  Bottom 0.305: 10B.1 33.02,195.58 24.77,187.32 24.77,161.93 25.4,161.29 IC3.25 | v61.28,161.29 60.96,161.61 60.96,167.32 v61.28,167.64 | IC1.33 71.75,153.67 72.39,154.31 72.39,160.66 73.03,161.29 73.03,167 v72.39,167.64
A3'  (via drill 0.6)
  Top 0.305: IC2.7 102.87,157.48 101.6,156.21 90.17,156.21 87.63,158.75 v80.01,158.75
  Bottom 0.305: v80.01,158.75 80.01,164.47 79.38,165.1 IC8.4
A4  (via drill 0.6)
  Top 0.305: v29.21,157.48 36.83,157.48 38.73,155.57 48.9,155.57 49.53,154.94 55.88,154.94 57.15,156.21 v60.64,156.21 IC1.34 v82.23,156.21 | IC7.10 90.49,110.49 v89.22,109.22
  Bottom 0.305: IC3.26 27.94,163.83 29.21,162.56 v29.21,157.48 | v60.64,156.21 60.33,156.53 60.33,177.16 59.05,178.44 59.05,189.23 60.96,191.13 60.96,193.99 63.5,196.53 22B.1 | v89.22,109.22 89.53,109.54 89.53,123.83 88.9,124.46 86.36,124.46 85.72,125.09 85.72,133.35 83.19,135.89 83.19,143.51 81.92,144.78 81.92,155.89 v82.23,156.21
A4'  (via drill 0.6)
  Top 0.305: IC7.9 99.06,107.95 100.33,109.22 114.62,109.22 v114.94,109.54 | v113.67,160.02 IC2.6
  Bottom 0.305: v114.94,109.54 115.57,110.17 115.57,122.87 113.03,125.41 113.03,147.96 113.67,148.59 v113.67,160.02
A5  (via drill 0.6)
  Top 0.305: IC3.1 11.43,170.18 12.7,171.45 41.27,171.45 43.81,173.99 47.62,173.99 48.9,172.72 v58.42,172.72 | v58.74,158.75 IC1.35 | IC7.6 86.04,113.03 84.45,111.44 84.45,109.86 83.82,109.22 78.74,109.22 76.2,111.76 73.66,111.76 71.12,114.3 v67.31,114.3
  Bottom 0.305: 21B.1 60.96,195.26 58.42,192.72 v58.42,172.72 58.42,164.47 59.05,163.83 59.05,159.07 v58.74,158.75 | IC1.35 67.94,158.75 67.31,158.12 67.31,140.65 66.67,140.02 66.67,127 66.04,126.36 66.04,120.65 67.94,118.75 67.94,114.94 v67.31,114.3
A5'  (via drill 0.6)
  Top 0.305: v105.09,114.3 99.06,114.3 96.52,111.76 90.17,111.76 88.9,110.49 IC7.7
  Bottom 0.305: IC2.5 107.95,162.56 108.58,161.93 108.58,131.44 107.31,130.18 107.31,125.73 106.05,124.46 106.05,120.02 105.41,119.38 105.41,114.62 v105.09,114.3
A6  (via drill 0.6)
  Top 0.305: IC3.2 24.13,166.37 25.4,167.64 v32.07,167.64 | 11A.1 35.56,195.58 v34.29,194.31 34.29,193.04 35.56,191.77 38.1,191.77 39.37,190.5 41.59,190.5 44.13,193.04 52.39,193.04 53.02,192.41 56.52,192.41 v58.42,194.31 | IC7.3 86.36,120.65 85.09,119.38 73.66,119.38 72.39,118.11 v66.04,118.11 | v65.72,134.62 62.23,134.62 60.96,133.35 IC1.16 43.18,133.35 41.27,135.25 v34.29,135.25
  Bottom 0.305: v34.29,194.31 33.66,193.68 33.66,175.26 31.75,173.35 31.75,167.96 v32.07,167.64 31.75,167.32 31.75,165.1 32.38,164.47 32.38,148.91 33.66,147.64 33.66,139.38 34.29,138.75 v34.29,135.25 | v66.04,118.11 65.41,118.75 65.41,126.68 66.04,127.32 66.04,134.3 | 66.04,134.94 v65.72,134.62 66.04,134.3 | 66.04,134.94 66.04,134.3 | 66.04,134.94 66.04,140.34 66.67,140.97 66.67,158.43 67.94,159.7 67.94,160.66 68.58,161.29 IC1.36 | 20B.1 v58.42,194.31
A6'  (via drill 0.6)
  Top 0.305: IC7.4 v92.71,118.11 | v91.76,127.64 95.89,127.64 97.79,129.54 104.46,129.54 105.73,128.27 v109.22,128.27
  Bottom 0.305: v92.71,118.11 92.08,118.75 92.08,127.32 v91.76,127.64 | v109.22,128.27 109.22,129.22 109.86,129.86 109.86,163.83 108.58,165.1 IC2.4
A7  (via drill 0.6)
  Top 0.305: IC3.3 24.13,163.83 25.4,162.56 27.94,162.56 29.21,163.83 52.07,163.83 53.34,162.56 v57.47,162.56 58.42,162.56 59.69,163.83 IC1.37 | v92.71,133.03 86.04,133.03 84.45,134.62 67.31,134.62 66.04,135.89 v57.47,135.89
  Bottom 0.305: 19B.1 55.88,172.72 57.15,171.45 57.15,162.88 v57.47,162.56 57.15,162.24 57.15,154.94 57.78,154.31 57.78,136.21 v57.47,135.89 | IC7.13 93.98,118.11 92.71,119.38 v92.71,133.03
A7'  (via drill 0.6)
  Top 0.305: v111.12,125.73 111.12,120.02 110.49,119.38 100.33,119.38 96.52,115.57 IC7.12
  Bottom 0.305: IC2.3 109.22,167.64 110.49,166.37 110.49,126.36 v111.12,125.73
A8  (via drill 0.6)
  Top 0.305: IC3.4 24.13,161.29 25.4,160.02 48.9,160.02 v49.21,159.7 | v49.53,165.1 67.94,165.1 69.22,166.37 IC1.38 86.36,166.37 87.63,167.64 IC6.3
  Bottom 0.305: v49.21,159.7 49.53,160.02 v49.53,165.1 49.53,168.28 51.44,170.18 51.44,185.42 50.8,186.06 50.8,192.72 53.34,195.26 18B.1
A8'  (via drill 0.6)
  Top 0.305: IC2.25 116.84,165.1 115.57,166.37 v114.3,166.37 97.79,166.37 96.52,165.1 IC6.4 | v110.49,75.56 109.86,75.56 109.22,76.2 105.41,76.2 104.78,76.83 90.81,76.83 89.53,75.56 78.11,75.56 77.47,74.93 77.47,73.34 76.52,72.39 73.66,72.39 70.48,75.56 65.41,75.56 64.77,74.93 64.77,73.03 64.14,72.39 60.96,72.39 57.15,76.2 50.8,76.2 50.16,75.56 40.64,75.56 38.73,73.66 D3.C
  Bottom 0.305: v114.3,166.37 114.94,165.74 114.94,146.69 114.3,146.05 114.3,126.05 116.84,123.51 116.84,107.63 114.94,105.73 114.94,100.97 115.57,100.33 115.57,82.87 114.3,81.6 114.3,76.83 113.03,75.56 v110.49,75.56
A9  (via drill 0.6)
  Top 0.305: v9.53,170.81 10.79,172.09 40.64,172.09 43.18,174.62 49.53,174.62 v50.16,173.99 v59.37,173.99 73.66,173.99 74.3,174.62 82.23,174.62 82.87,175.26 88.9,175.26 89.53,174.62 118.75,174.62 v119.38,173.99 | v59.37,168.91 IC1.39 | D4.C 50.8,73.66 52.7,75.56 56.52,75.56 v58.42,73.66
  Bottom 0.305: IC3.5 9.53,158.75 8.89,159.38 8.89,170.18 v9.53,170.81 | v50.16,173.99 49.53,174.62 49.53,194.31 50.8,195.58 17B.1 | IC2.24 120.65,162.56 120.02,163.19 120.02,170.81 119.38,171.45 v119.38,173.99 | v59.37,173.99 v59.37,168.91 59.37,164.78 59.69,164.47 59.69,158.12 59.05,157.48 59.05,114.3 60.33,113.03 60.33,80.64 58.42,78.74 v58.42,73.66
A10  (via drill 0.6)
  Top 0.305: IC3.6 24.13,156.21 25.4,157.48 27.94,157.48 30.48,154.94 48.26,154.94 v48.58,154.62 | v49.53,170.18 58.42,170.18 59.69,171.45 v64.45,171.45 IC1.40 72.07,171.45 74.61,173.99 82.55,173.99 83.19,174.62 88.27,174.62 88.9,173.99 116.52,173.99 v117.16,173.35
  Bottom 0.305: v48.58,154.62 48.26,154.94 48.26,168.28 49.85,169.86 49.85,170.18 | v49.53,170.18 49.85,170.18 | 49.85,170.18 49.85,172.4 48.26,173.99 16B.1 | IC2.21 119.38,154.94 118.75,155.57 118.75,169.54 117.16,171.13 v117.16,173.35 | v64.45,171.45 64.77,171.13 64.77,161.93 63.5,160.66 63.5,142.56 62.23,141.29 62.23,136.84 62.87,136.21 62.87,127.32 63.5,126.68 63.5,124.46 61.59,122.56 61.59,74.3 D5.C
A11  (via drill 0.6)
  Top 0.305: v13.02,170.18 13.65,170.81 41.91,170.81 44.45,173.35 46.99,173.35 v48.9,171.45 IC1.1 58.74,171.45 60.01,172.72 v65.09,172.72 | IC2.23 118.75,160.02 117.47,161.29 72.39,161.29 71.12,160.02 65.41,160.02 v64.77,160.66
  Bottom 0.305: IC3.7 12.7,153.67 13.34,154.31 13.34,169.86 v13.02,170.18 | 15B.1 45.72,174.62 v48.9,171.45 | v65.09,172.72 65.41,172.4 65.41,161.29 v64.77,160.66 64.14,160.02 64.14,142.24 62.87,140.97 62.87,137.16 63.5,136.53 63.5,127.64 64.14,127 64.14,123.83 62.23,121.92 62.23,80.01 65.41,76.83 73.98,76.83 74.93,75.88 D6.C
A12  (via drill 0.6)
  Top 0.305: IC3.8 9.84,151.13 8.89,152.08 8.89,166.37 10.16,167.64 12.7,167.64 15.24,170.18 39.37,170.18 v40.64,168.91 42.55,168.91 44.45,167 46.99,167 48.9,168.91 IC1.2 | v56.83,153.67 58.1,154.94 74.93,154.94 76.83,153.03 88.9,153.03 | v88.9,153.35 88.9,153.03 | 88.9,153.03 104.14,153.03 104.78,153.67 v111.44,153.67
  Bottom 0.305: v40.64,168.91 40.64,180.97 39.37,182.25 39.37,193.04 40.64,194.31 41.91,194.31 43.18,195.58 14B.1 | IC1.2 55.88,168.91 56.52,168.28 56.52,153.99 v56.83,153.67 | v88.9,153.35 89.53,152.72 89.53,141.6 90.81,140.34 90.81,126.36 91.44,125.73 91.44,118.11 92.71,116.84 92.71,77.47 88.9,73.66 D7.C | v111.44,153.67 111.12,153.99 111.12,167.64 108.58,170.18 IC2.2
A13  (via drill 0.6)
  Top 0.305: v14.29,165.1 v38.1,165.1 48.26,165.1 49.53,166.37 IC1.3 v67.63,166.37
  Bottom 0.305: IC3.9 12.7,148.59 13.97,149.86 13.97,164.78 v14.29,165.1 | v38.1,165.1 38.1,193.04 40.64,195.58 13B.1 | v67.63,166.37 67.31,166.05 67.31,160.02 66.04,158.75 66.04,141.29 65.41,140.65 65.41,136.53 64.77,135.89 64.77,133.35 65.41,132.72 65.41,127.64 64.77,127 64.77,123.19 62.87,121.28 62.87,80.33 65.09,78.11 81.28,78.11 82.55,76.83 82.55,72.39 83.82,71.12 87.63,71.12 91.44,74.93 96.52,74.93 97.79,73.66 D8.C
A14  (via drill 0.6)
  Top 0.305: v97.16,181.61 v53.34,181.61 47.62,181.61 46.35,182.88 v36.83,182.88
  Bottom 0.305: IC6.10 IC6.11 97.79,160.02 96.52,161.29 96.52,180.97 v97.16,181.61 | v53.34,181.61 52.7,180.97 52.7,165.1 53.98,163.83 IC1.4 | v36.83,182.88 36.83,193.04 38.1,194.31 12B.1
A14'  (via drill 0.6)
  Top 0.305: IC13.13 69.85,93.98 71.12,92.71 82.55,92.71 85.09,95.25 v107.95,95.25 | v107.31,124.46 99.69,124.46 v99.06,125.09
  Bottom 0.305: 107.95,83.82 v107.95,95.25 107.95,105.41 106.68,106.68 106.68,123.83 v107.31,124.46 | 107.95,83.82 107.95,75.56 109.86,73.66 D9.C | IC12.9 107.95,83.82 | v99.06,125.09 99.06,131.76 97.79,133.03 97.79,153.67 IC6.9
A15  (via drill 0.6)
  Top 0.305: IC6.13 97.79,165.1 96.52,163.83 76.2,163.83 74.93,162.56 59.69,162.56 58.42,161.29 IC1.5 53.34,161.29 52.07,162.56 v33.66,162.56
  Bottom 0.305: IC23.4 112.08,115.57 111.12,116.52 111.12,123.83 108.27,126.68 108.27,129.86 109.22,130.81 109.22,162.56 107.95,163.83 104.14,163.83 102.87,165.1 IC6.13 IC6.14 | v33.66,162.56 34.29,163.19 34.29,193.04 35.56,194.31 11B.1
A15'  (via drill 0.6)
  Top 0.305: v42.55,78.74 43.18,78.11 67.63,78.11 68.26,77.47 83.82,77.47 84.45,76.83 88.27,76.83 89.53,78.11 106.05,78.11 106.68,77.47 111.76,77.47 113.03,76.2 115.57,76.2 116.84,74.93 125.73,74.93 D10.C 146.05,73.66 v146.69,74.3 | v148.27,162.56 143.51,162.56 142.24,163.83 132.08,163.83 129.54,166.37 125.73,166.37 123.19,163.83 105.41,163.83 104.14,162.56 IC6.12
  Bottom 0.305: IC16.4 43.18,88.9 43.81,88.27 43.81,80.01 v42.55,78.74 | v146.69,74.3 147.96,75.56 147.96,94.61 148.59,95.25 148.59,104.14 150.5,106.05 150.5,114.94 151.76,116.2 151.76,147.96 148.59,151.13 148.59,162.24 v148.27,162.56
CPUCLK  (via drill 0.6)
  Top 0.305: R20.1 IC1.6 | IC15.12 39.37,91.44 v39.69,91.12
  Bottom 0.305: IC15.12 33.02,91.44 32.38,90.81 32.38,87 33.02,86.36 IC15.10 | v39.69,91.12 39.37,91.44 39.37,109.22 46.35,116.2 46.35,121.92 52.07,127.64 52.07,131.76 49.53,134.3 49.53,154.31 50.8,155.57 R20.1
D0  (via drill 0.6)
  Top 0.305: v10.16,114.3 IC10.7 17.78,114.3 19.05,113.03 27.94,113.03 30.48,115.57 34.29,115.57 35.56,116.84 IC9.11 v45.09,116.84 | IC1.14 R4.2 v45.72,138.43
  Bottom 0.305: v10.16,114.3 9.53,113.67 9.53,89.53 10.16,88.9 IC14.4 | v45.09,116.84 45.72,117.47 45.72,122.56 46.35,123.19 46.35,137.79 v45.72,138.43
D0'  (via drill 0.6)
  Top 0.305: 4A.1 v17.78,193.04 | IC3.11 12.7,143.51 13.97,142.24 v17.78,142.24 33.02,142.24 35.56,139.7 41.91,139.7 R4.1 44.45,139.7 71.12,139.7 72.39,138.43 v79.38,138.43 | IC2.11 104.14,147.32 102.87,148.59 80.01,148.59 v79.38,147.96
  Bottom 0.305: v17.78,193.04 18.41,192.41 18.41,142.88 v17.78,142.24 | IC5.7 76.2,115.57 77.47,116.84 77.47,130.49 79.38,132.4 v79.38,138.43 v79.38,147.96
D1  (via drill 0.6)
  Top 0.305: IC14.2 12.7,93.98 16.51,97.79 20.95,97.79 21.59,98.42 21.59,100.33 v22.23,100.97 | IC10.9 29.53,111.76 30.8,110.49 34.29,110.49 36.83,113.03 43.18,113.03 43.81,113.67 v46.99,113.67 | v48.26,119.38 IC9.12 | R5.2 52.07,135.25 52.7,135.89 IC1.15
  Bottom 0.305: v22.23,100.97 21.59,101.6 21.59,110.49 IC10.9 | v46.99,113.67 48.26,114.94 v48.26,119.38 48.26,121.92 53.34,127 55.88,127 56.52,127.64 56.52,133.99 IC1.15
D1'  (via drill 0.6)
  Top 0.305: 5A.1 20.32,195.58 v19.05,194.31 | R5.1 42.55,135.25 41.91,135.89 35.56,135.89 34.29,137.16 v19.05,137.16 16.51,137.16 12.7,140.97 IC3.12 | v80.33,146.05 102.87,146.05 104.14,144.78 IC2.12 | IC5.14 79.38,115.57 78.11,116.84 63.5,116.84 62.23,118.11 v43.81,118.11
  Bottom 0.305: v19.05,194.31 v19.05,137.16 | IC5.14 81.28,115.57 80.01,116.84 80.01,128.27 80.64,128.91 80.64,145.73 v80.33,146.05 | v43.81,118.11 43.81,122.87 45.09,124.14 45.09,133.99 43.81,135.25 R5.1
D2  (via drill 0.6)
  Top 0.305: IC10.11 27.94,116.84 29.21,118.11 33.02,118.11 36.83,121.92 IC9.13 v44.77,121.92 | IC1.12 R6.2 v45.4,143.51
  Bottom 0.305: IC10.11 21.59,116.84 20.95,116.2 20.95,87 20.32,86.36 IC14.10 | v44.77,121.92 44.77,122.87 45.72,123.83 45.72,137.16 44.45,138.43 44.45,139.7 45.72,140.97 45.72,143.19 v45.4,143.51
D2'  (via drill 0.6)
  Top 0.305: 6A.1 v22.86,194.31 | v40.96,144.78 v22.23,144.78 9.53,144.78 8.89,144.15 8.89,139.38 9.84,138.43 IC3.13 | v84.45,132.72 85.09,132.08 v105.41,132.08 | v82.23,139.7 81.92,139.7 79.38,142.24 68.58,142.24 67.31,140.97 57.15,140.97 55.88,142.24 44.45,142.24 R6.1
  Bottom 0.305: v22.86,194.31 20.32,191.77 20.32,151.13 22.23,149.22 v22.23,144.78 | v40.96,144.78 41.91,144.78 R6.1 | IC5.17 84.45,123.19 85.09,123.83 85.09,132.08 v84.45,132.72 82.23,134.94 v82.23,139.7 | v105.41,132.08 104.78,132.72 104.78,141.6 105.41,142.24 IC2.13
D3  (via drill 0.6)
  Top 0.305: IC1.8 R7.2 v45.4,153.67 | v10.79,119.38 IC10.5 17.78,119.38 19.05,120.65 25.4,120.65 27.94,123.19 34.29,123.19 35.56,124.46 IC9.14 v47.31,124.46
  Bottom 0.305: v10.79,119.38 10.79,116.2 8.89,114.3 8.89,84.45 9.53,83.82 IC14.6 | v47.31,124.46 47.31,125.09 46.99,125.41 46.99,144.46 46.35,145.1 46.35,152.72 v45.4,153.67
D3'  (via drill 0.6)
  Top 0.305: 9A.1 30.48,193.04 29.21,191.77 v21.59,191.77 | v23.18,147.32 29.21,147.32 29.84,147.96 v43.18,147.96 43.81,147.32 64.77,147.32 67.31,144.78 71.44,144.78 73.34,146.69 76.83,146.69 81.28,142.24 v81.92,142.24 88.9,142.24 90.17,140.97 119.38,140.97 120.65,139.7 IC2.15
  Bottom 0.305: v21.59,191.77 20.95,191.13 20.95,151.76 23.5,149.22 23.5,147.32 | R7.1 v43.18,147.96 | IC3.15 24.77,135.89 23.5,137.16 23.5,147 | IC5.18 83.5,125.73 84.45,126.68 84.45,131.44 81.28,134.62 81.28,141.6 v81.92,142.24
  Bottom 0.406: 23.5,147.32 v23.18,147.32 23.5,147
D4  (via drill 0.6)
  Top 0.305: IC10.13 25.4,121.92 27.94,124.46 IC9.3 34.29,124.46 35.56,125.73 v43.18,125.73 | v40.01,156.53 40.64,156.53 40.96,156.21 IC1.7
  Bottom 0.305: IC10.13 24.13,121.92 24.77,121.28 24.77,104.78 23.5,103.5 23.5,100.33 21.59,98.42 21.59,82.55 20.32,81.28 IC14.8 | v43.18,125.73 44.45,127 44.45,132.08 40.64,135.89 R8.2 40.64,139.7 40.01,140.34 v40.01,156.53
D4'  (via drill 0.6)
  Top 0.305: IC3.16 R8.1 34.29,138.43 36.2,136.53 45.09,136.53 47.62,133.99 52.07,133.99 52.7,134.62 v60.64,134.62 | v106.05,127 103.5,127 102.87,127.64 97.16,127.64 96.52,127 93.98,127 91.44,124.46 81.28,124.46 80.01,125.73 IC5.3 72.39,125.73 71.12,127 63.5,127 62.23,128.27 v60.64,128.27 | v104.78,143.51 109.22,143.51 110.49,142.24 IC2.16 | v33.02,194.31 10A.1
  Bottom 0.305: v106.05,127 106.05,129.54 104.14,131.44 104.14,142.88 v104.78,143.51 | v60.64,128.27 v60.64,134.62 | R8.1 33.02,147.32 31.75,148.59 31.75,163.83 31.11,164.47 31.11,173.99 33.02,175.9 v33.02,194.31
D5  (via drill 0.6)
  Top 0.305: IC14.12 v22.86,91.44 | IC9.4 34.29,121.92 35.56,123.19 v41.27,123.19 | v38.42,151.13 39.05,151.76 52.7,151.76 53.34,151.13 IC1.9
  Bottom 0.305: v22.86,91.44 22.86,98.74 24.13,100.01 24.13,102.87 29.21,107.95 29.21,121.28 29.84,121.92 IC9.4 | v41.27,123.19 41.27,132.72 38.73,135.25 38.73,140.97 | 38.73,140.97 38.73,150.81 v38.42,151.13 | R9.2 38.73,140.97
D5'  (via drill 0.6)
  Top 0.305: 8A.1 27.94,193.99 26.99,193.04 v22.86,193.04 | v120.65,137.16 114.3,137.16 113.03,135.89 96.52,135.89 93.98,138.43 90.17,138.43 88.9,137.16 v73.66,137.16 36.83,137.16 33.02,140.97 R9.1
  Top 0.406: IC3.17 R9.1
  Bottom 0.305: 22.86,191.77 21.59,190.5 21.59,152.4 24.13,149.86 24.13,142.24 25.4,140.97 | IC5.4 73.66,123.19 73.03,123.83 73.03,136.53 v73.66,137.16 | v120.65,137.16 119.38,138.43 119.38,143.51 120.65,144.78 IC2.17
  Bottom 0.406: v22.86,193.04 22.86,191.77 | 25.4,140.97 IC3.17
D6  (via drill 0.6)
  Top 0.305: v30.8,143.51 R10.2 | v37.47,148.91 37.78,149.22 43.81,149.22 44.45,148.59 IC1.10
  Bottom 0.305: v30.8,143.51 31.11,143.19 31.11,134.3 D11.A 32.7,133.67 33.66,132.72 33.66,120.02 33.02,119.38 IC9.5 30.48,119.38 29.84,118.75 29.84,107.31 24.77,102.23 24.77,99.69 24.13,99.06 24.13,85.09 25.4,83.82 IC15.6 | R10.2 37.15,143.51 38.1,144.46 38.1,148.27 v37.47,148.91
D6'  (via drill 0.6)
  Top 0.305: 7A.1 25.4,195.58 v24.13,194.31 | IC3.18 v15.24,143.51 | v11.43,79.38 12.06,78.74 40.64,78.74 41.59,79.69 43.5,79.69 44.45,78.74 53.34,78.74 | 53.34,78.74 v53.34,79.06 | 53.34,78.74 67.94,78.74 68.58,78.11 84.45,78.11 85.09,77.47 87.63,77.47 88.9,78.74 106.68,78.74 107.31,78.11 112.39,78.11 v113.03,77.47 | v113.98,147.32 IC2.18
  Top 0.406: IC3.18 R10.1
  Bottom 0.305: 24.13,191.77 22.23,189.87 22.23,153.03 24.77,150.5 24.77,144.15 25.4,143.51 | v15.24,143.51 14.61,142.88 14.61,134.3 10.16,129.86 10.16,128.27 9.53,127.64 9.53,116.2 8.26,114.94 8.26,80.64 9.53,79.38 v11.43,79.38 | v53.34,79.06 53.34,86.36 | 53.34,86.36 R28.1 | IC13.5 53.34,86.36 | v113.03,77.47 113.67,78.11 113.67,81.92 114.94,83.19 114.94,99.69 114.3,100.33 114.3,106.68 116.2,108.58 116.2,123.19 113.67,125.73 113.67,147 v113.98,147.32
  Bottom 0.406: v24.13,194.31 24.13,191.77 | 25.4,143.51 IC3.18
D7  (via drill 0.6)
  Top 0.305: v16.83,118.11 19.37,115.57 27.94,115.57 29.21,116.84 IC9.6 | v31.43,146.05 R11.2 41.27,146.05 41.91,145.41 41.91,141.6 42.55,140.97 IC1.13
  Bottom 0.305: IC10.3 16.51,124.46 17.14,123.83 17.14,118.43 v16.83,118.11 | IC9.6 33.66,116.84 | 33.66,116.84 33.66,111.12 33.02,110.49 33.02,97.79 31.11,95.89 31.11,90.81 29.21,88.9 IC15.4 | 33.66,116.84 34.29,117.47 34.29,133.35 31.75,135.89 31.75,145.73 v31.43,146.05
D7'  (via drill 0.6)
  Top 0.305: 1A.1 10.16,195.58 15.24,190.5 v15.24,187.96 | v13.97,146.05 IC3.19 R11.1 30.48,147.32 41.91,147.32 44.45,144.78 55.88,144.78 57.15,143.51 v61.91,143.51 | v104.78,122.56 104.14,121.92 99.69,121.92 99.06,121.28 99.06,119.38 96.52,116.84 86.36,116.84 85.09,115.57 85.09,114.3 83.82,113.03 IC5.13 79.38,113.03 78.11,114.3 72.39,114.3 71.12,115.57 63.5,115.57 62.23,116.84 v60.64,116.84 | v104.14,146.05 109.22,146.05 113.03,149.86 IC2.19
  Bottom 0.305: v15.24,187.96 15.24,147.32 v13.97,146.05 | v104.78,122.56 104.78,127 105.41,127.64 105.41,128.91 103.5,130.81 103.5,145.41 v104.14,146.05 | v60.64,116.84 60.64,117.47 60.96,117.79 60.96,126.05 61.59,126.68 61.59,135.57 60.96,136.21 60.96,142.56 v61.91,143.51
FINAL_VIDEO
  Top 0.406: JP6.2 68.58,192.09 69.53,193.04 X5.2@2 X5.2
GND  (via drill 0.6)
  Top 0.406: X5.1 75.04,196.96 R38.1 | IC14.7 15.24,81.28 16.51,82.55 20.32,82.55 21.59,81.28 IC15.7 29.21,81.28 30.48,80.01 35.56,80.01 36.83,81.28 IC16.7 45.72,81.28 46.99,80.01 50.8,80.01 52.07,81.28 IC13.7 62.23,81.28 63.5,80.01 66.04,80.01 67.31,81.28 IC17.7 74.93,81.28 76.2,82.55 82.55,82.55 83.82,81.28 IC11.7 95.25,81.28 96.52,82.55 99.06,82.55 100.33,81.28 IC12.7 107.95,81.28 109.22,80.01 118.11,80.01 119.38,81.28 IC18.7 | C6.2 139.7,97.79 ZX81LED.K 153.03,97.79 153.67,98.42 153.67,179.07 | 153.67,179.07 153.67,193.99 | 153.67,193.99 153.67,202.88 153.35,203.2 148.59,203.2 | 148.59,203.2 139.06,203.2 | 139.06,203.2 134.3,203.2 | 134.3,203.2 120.65,203.2 | IC5.10 80.01,107.95 81.28,106.68 85.09,106.68 86.36,107.95 IC7.8 88.9,107.95 90.17,106.68 99.06,106.68 100.33,107.95 IC19.7 102.87,107.95 104.14,106.68 110.49,106.68 111.76,107.95 IC23.7 | IC8.8 82.55,154.94 83.82,156.21 88.9,156.21 90.17,154.94 IC6.8 | C18.2 146.05,179.07 | 146.05,179.07 153.67,179.07 | U3.7 142.24,178.44 142.88,179.07 146.05,179.07 | U4.7 136.53,129.54 135.25,128.27 129.54,128.27 | 129.54,128.27 C17.2 | U2.7 125.73,128.27 | 125.73,128.27 129.54,128.27 | 125.73,128.27 119.7,128.27 119.38,127.95 C20.2 | IC7.15 v99.06,123.19 | X3.1 148.39,203 148.59,203.2 | X3.2 153.66,194 153.67,193.99 | X2.1 134.42,203.09 134.3,203.2 | X2.2 138.89,196.85 | 138.89,196.85 138.89,203.02 139.06,203.2 | 113.03,188.59 112.39,187.96 92.71,187.96 | R34.2 113.03,188.59 | 113.03,188.59 120.65,188.59 | 120.65,188.59 121.92,188.59 | 121.92,188.59 123.19,188.59 128.59,193.99 131.76,193.99 134.62,196.85 138.89,196.85 | J1.3 120.65,188.59
  Top 0.406: 92.71,187.96 R37.S | v86.36,187.96 92.71,187.96 | C13.2 121.92,188.59
  Top 0.61: IC22.2 7.62,181.61 6.35,180.34 6.35,177.16 6.99,176.53 10.79,176.53 11.43,175.9 C23.- | IC3.14 11.43,133.99 12.06,133.35 19.05,133.35 20.32,132.08 R1.1 C1.2 | C3.2 10.16,99.06 8.89,97.79 8.89,81.92 9.53,81.28 IC14.7 | IC23.7 115.57,107.95 118.11,110.49 IC23.9 122.56,110.49 125.09,107.95 U5.7 | C5.2 C15.1 128.27,74.93 137.79,74.93 138.43,75.56 138.43,76.17 XTAL.2 | IC1.29 70.48,143.51 70.8,143.19 75.88,143.19 76.2,143.51 C10.- | IC8.15 87.63,170.18 88.9,168.91 v93.34,168.91 96.52,168.91 97.79,170.18 IC6.15 | IC23.13 119.38,120.65 118.75,121.28 118.75,124.14 119.38,124.78 C20.2 | U1.7 142.24,152.4 140.97,151.13 125.73,151.13 | 125.73,151.13 125.41,151.13 125.09,151.45 125.09,152.08 | 125.09,152.08 125.09,162.56 127,164.47 S2.3 | 125.09,152.08 124.78,152.4 IC2.20 119.38,152.4 118.11,151.13 113.03,151.13 110.49,148.59 104.14,148.59 102.87,149.86 IC21.14 | C16.2 125.73,151.13 | IC2.14 IC21.10 | IC9.8 34.29,111.76 36.83,114.3 IC9.10 R25.1
  Bottom 0.406: C22.1 69.85,177.8 | 69.85,177.8 69.85,191.77 R38.1 | IC24.4 69.85,177.8 | IC19.7 100.33,107.95 99.06,109.22 v99.06,123.19 102.23,126.36 102.23,139.06 101.6,139.7 IC21.10 | R40.1 v86.36,187.96 85.09,187.96 80.64,192.41 X5.1 | C2.2 IC9.8 | C19.2 109.22,188.59 109.86,189.23 109.86,190.07 S3.1
  Bottom 0.61: 17.78,195.58 13.97,191.77 C8.- 13.97,182.25 13.34,181.61 IC22.2 | C23.- 11.43,175.9 10.79,176.53 6.99,176.53 6.35,175.9 6.35,137.16 7.62,135.89 IC3.14 | IC23.13 IC23.12 119.7,118.11 118.75,117.16 118.75,113.67 119.38,113.03 IC23.10 IC23.9 122.56,108.58 122.56,93.98 | JP1.1 35.56,139.7 36.83,138.43 C1.2 36.83,129.54 37.47,128.91 37.47,127 | IC10.8 R2.1 15.24,105.41 | 15.24,105.41 POWERLED.K | C3.2 13.97,100.33 15.24,101.6 15.24,105.41 | IC18.2 122.56,93.98 | IC18.7 122.56,81.28 | 122.56,81.28 122.56,76.83 121.92,76.2 C5.2 | 122.56,81.28 122.56,93.98 | XTAL.2 138.4,77.5 135.25,80.64 135.25,81.28 | 135.25,81.28 135.25,96.52 | IC20.7 135.25,81.28 | 135.25,96.52 IC20.1 | 135.25,96.52 135.25,97.16 137.16,99.06 C6.2 138.43,106.68 U6.7 | IC5.1 74.93,133.35 | 74.93,133.35 74.93,135.89 76.2,137.16 C10.- v76.2,149.86 76.2,150.5 77.47,151.76 IC8.8 | C4.2 74.93,133.35 | IC6.8 92.71,154.94 93.34,155.57 93.34,162.56 | 93.34,162.56 IC6.5 | 93.34,162.56 v93.34,168.91 93.34,178.44 92.71,179.07 R37.S | C20.2 119.38,135.25 118.11,136.53 118.11,150.5 120.02,152.4 IC2.20 | IC16.7 40.96,81.28 38.42,83.82 38.42,109.86 37.47,110.81 37.47,114.3 | IC9.15 37.47,127 | 37.47,127 37.47,114.3 | 37.47,114.3 IC9.10 | 4B.1 17.78,195.58 | 17.78,195.58 20.32,195.58 5B.1
  other vias: 29.21,189.23 36.2,177.16 133.35,170.18 57.15,119.38 51.75,167.64
  pour Bottom (isolate 0.305): 0,68.26 155.57,68.26 155.57,204.15 0,204.15
  pour Top (isolate 0.305): 0,68.26 155.57,68.26 155.57,204.15 0,204.15
GND1  (via drill 3.4)
  other vias: 45.8,170.2
GND2  (via drill 3.4)
  other vias: 135.5,167.4
GND3  (via drill 3.4)
  other vias: 46.2,109.2
HSYNC  (via drill 0.6)
  Top 0.305: U2.8 135.25,129.54 136.53,130.81 140.97,130.81 v142.24,129.54
  Bottom 0.305: U6.5 140.97,113.03 141.6,113.67 141.6,118.11 142.24,118.75 v142.24,129.54 143.51,130.81 143.51,140.97 144.78,142.24 U4.13
IC5_PIN9  (via drill 0.6)
  Top 0.305: U6.9 148.59,110.49 149.22,109.86 149.22,107.31 148.59,106.68 131.13,106.68 130.49,106.05 113.67,106.05 113.03,105.41 100.33,105.41 99.69,106.05 89.53,106.05 88.9,106.68 86.36,106.68 85.72,106.05 80.33,106.05 79.06,107.31 77.79,107.31 77.15,106.68 73.66,106.68 73.03,107.31 73.03,109.22 | 73.03,109.22 73.03,109.86 73.66,110.49 IC5.9 | v66.67,109.86 67.31,109.22 73.03,109.22
  Bottom 0.305: IC13.11 66.04,88.9 66.67,89.53 v66.67,109.86
IC11_PIN10  (via drill 0.6)
  Top 0.305: v100.97,106.36 103.19,106.36 103.5,106.05 112.39,106.05 113.03,106.68 129.22,106.68 130.49,107.95 v130.49,111.76 137.16,111.76 138.43,110.49 U6.6
  Bottom 0.305: IC11.10 99.06,86.36 100.97,88.27 v100.97,106.36 98.74,106.36 97.79,107.31 97.79,130.81 96.52,132.08 96.52,143.51 95.25,144.78 IC21.3 IC21.2 | v130.49,111.76 130.49,117.16 129.54,118.11 U5.3
IC11_PIN11  (via drill 0.6)
  Top 0.305: U5.2 123.83,120.65 v122.56,121.92 | v123.83,103.82 123.51,103.82 115.25,103.82 114.94,103.5 99.06,103.5 v98.74,103.82